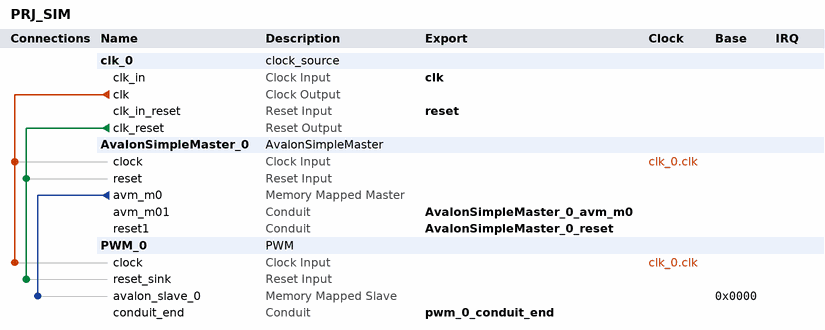
[diagram p0: system contents]
# Platform Designer (Qsys) system PRJ_SIM, MAX 10 10M50DAF484C6GES
# Parameters at their usual value, and those the tool derives, are not listed.
package require -exact qsys 17.1
create_system PRJ_SIM
set_project_property DEVICE_FAMILY {MAX 10}
set_project_property DEVICE 10M50DAF484C6GES

add_instance clk_0 clock_source 17.1
set_instance_parameter_value clk_0 clockFrequency 50000000

add_instance AvalonSimpleMaster_0 AvalonSimpleMaster 1.0

add_instance PWM_0 PWM 1.0
set_instance_parameter_value PWM_0 wDATA_WIDTH 8

# connections
add_connection clk_0.clk AvalonSimpleMaster_0.clock clock
add_connection clk_0.clk PWM_0.clock clock
add_connection clk_0.clk_reset AvalonSimpleMaster_0.reset reset
add_connection clk_0.clk_reset PWM_0.reset_sink reset
add_connection AvalonSimpleMaster_0.avm_m0 PWM_0.avalon_slave_0 avalon
set_connection_parameter_value AvalonSimpleMaster_0.avm_m0/PWM_0.avalon_slave_0 baseAddress 0x0000

# exported interfaces
add_interface AvalonSimpleMaster_0_avm_m0 conduit end
set_interface_property AvalonSimpleMaster_0_avm_m0 EXPORT_OF AvalonSimpleMaster_0.avm_m01
add_interface AvalonSimpleMaster_0_reset conduit end
set_interface_property AvalonSimpleMaster_0_reset EXPORT_OF AvalonSimpleMaster_0.reset1
add_interface clk clock sink
set_interface_property clk EXPORT_OF clk_0.clk_in
add_interface pwm_0_conduit_end conduit end
set_interface_property pwm_0_conduit_end EXPORT_OF PWM_0.conduit_end
add_interface reset reset sink
set_interface_property reset EXPORT_OF clk_0.clk_in_reset

set_interconnect_requirement {$system} qsys_mm.clockCrossingAdapter HANDSHAKE
set_interconnect_requirement {$system} qsys_mm.enableEccProtection FALSE
set_interconnect_requirement {$system} qsys_mm.insertDefaultSlave FALSE
set_interconnect_requirement {$system} qsys_mm.maxAdditionalLatency 1

save_system PRJ_SIM.qsys
